# EAGLE schematic Initial v1 (EAGLE 9.6.2)
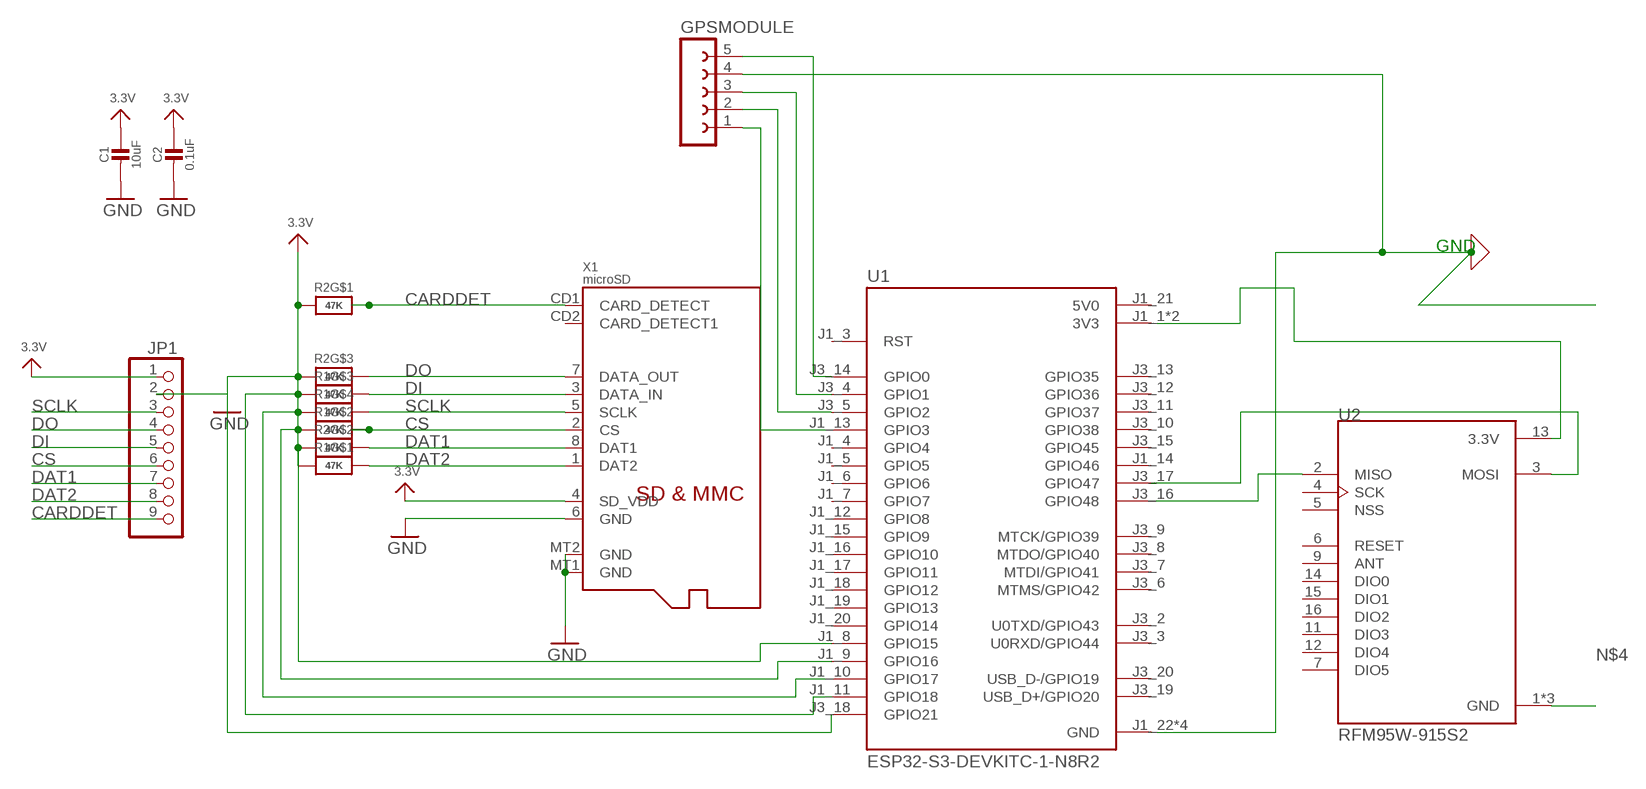
[diagram p0: schematic, sheet 1]

## Parts
C1  10uF  CAP_CERAMIC0805-NOOUTLINE  [0805-NO]
C2  0.1uF  CAP_CERAMIC0603_NO  [0603-NO]
GPSMODULE  FE05-1  [FE05-1]
JP1  HEADER-1X970MIL  [1X09_ROUND_70]
R1  47K  RESISTOR_4PACK  [RESPACK_4X0603]
R2  47K  RESISTOR_4PACK  [RESPACK_4X0603]
U1  ESP32-S3-DEVKITC-1-N8R2  [XCVR_ESP32-S3-DEVKITC-1-N8R2]
U2  RFM95W-915S2  [XCVR_RFM95W-915S2]
X1  microSD  MICROSD  [MICROSD]

## Nets
0: GPSMODULE.4 U1.J1_22(GND) U1.J3_1(GND) U1.J3_21(GND) U1.J3_22(GND) ; supply symbol labelled GND
3.3V: C1.1 C2.1 JP1.1 R1.1 R1.2 R1.3 R1.4 R2.1 R2.2 R2.3 U1.J1_8(GPIO15) U1.J1_9(GPIO16) U1.J1_10(GPIO17) U1.J1_11(GPIO18) U1.J3_18(GPIO21) X1.4(SD_VDD)
CARDDET: JP1.9 R2.8 X1.CD1(CARD_DETECT)
CS: JP1.6 R1.7 X1.2(CS)
DAT1: JP1.7 R2.7 X1.8(DAT1)
DAT2: JP1.8 R1.8 X1.1(DAT2)
DI: JP1.5 R1.6 X1.3(DATA_IN)
DO: JP1.4 R2.6 X1.7(DATA_OUT)
GND: C1.2 C2.2 JP1.2 X1.6(GND) X1.MT1(GND) X1.MT2(GND)
N$1: U1.J1_1(3V3) U1.J1_2(3V3) U2.13(3.3V)
N$2: U1.J3_17(GPIO47) U2.3(MOSI)
N$3: U1.J3_16(GPIO48) U2.2(MISO)
N$4: U2.1(GND) U2.8(GND) U2.10(GND)
N$5: GPSMODULE.5 U1.J3_14(GPIO0)
N$6: GPSMODULE.3 U1.J3_4(GPIO1)
N$7: GPSMODULE.2 U1.J3_5(GPIO2)
N$8: GPSMODULE.1 U1.J1_13(GPIO3)
SCLK: JP1.3 R1.5 X1.5(SCLK)
Unconnected: R2.4 R2.5 U1.J1_3(RST) U1.J1_4(GPIO4) U1.J1_5(GPIO5) U1.J1_6(GPIO6) U1.J1_7(GPIO7) U1.J1_12(GPIO8) U1.J1_14(GPIO46) U1.J1_15(GPIO9) U1.J1_16(GPIO10) U1.J1_17(GPIO11) U1.J1_18(GPIO12) U1.J1_19(GPIO13) U1.J1_20(GPIO14) U1.J3_2(U0TXD/GPIO43) U1.J3_3(U0RXD/GPIO44) U1.J3_6(MTMS/GPIO42) U1.J3_7(MTDI/GPIO41) U1.J3_8(MTDO/GPIO40) U1.J3_9(MTCK/GPIO39) U1.J3_10(GPIO38) U1.J3_11(GPIO37) U1.J3_12(GPIO36) U1.J3_13(GPIO35) U1.J3_15(GPIO45) U1.J3_19(USB_D+/GPIO20) U1.J3_20(USB_D-/GPIO19) U2.4(SCK) U2.5(NSS) U2.6(RESET) U2.7(DIO5) U2.9(ANT) U2.11(DIO3) U2.12(DIO4) U2.14(DIO0) U2.15(DIO1) U2.16(DIO2) X1.CD2(CARD_DETECT1)

## Notes on the sheet
- GND

## Power pins joined to a net without a drawn wire
5V0: U1.J1_21(5V0)

## Library data of the parts
C1 C2 = microbuilder:CAP_CERAMIC: Ceramic Capacitors For new designs, use the packages preceded by an '_' character since they are more reliable: The following footprints should be used on most boards: _0402 - Standard footprint for regular board layouts _0603 - Standard footprint for regular board layouts _0805 - Standard footprint for regular board layouts _1206 - Standard footprint for regular board layouts For extremely tight-pitch boards where space is at a premium, the following 'micro-pitch' footprints can be used (smaller pads, no silkscreen outline, etc.): _0402MP - Micro-pitch footprint for very dense/compact boards _0603MP - Micro-pitch footprint for very dense/compact boards _0805MP - Micro-pitch footprint for very dense/compact boards _1206MP - Micro-pitch footprint for very dense/compact boards
GPSMODULE = con-lsta:FE05-1: FEMALE HEADER; OC_FARNELL: unknown; OC_NEWARK: unknown
JP1 = microbuilder:HEADER-1X9: PIN HEADER
R1 R2 = microbuilder:RESISTOR_4PACK: Resistor Packs (4 resistors) 4 x 0603 10K 1/16W - Digikey: YC164J-10KCT-ND
U1 = ESP32-S3-DEVKITC-1-N8R2:ESP32-S3-DEVKITC-1-N8R2: Check availability <https://pricing.snapeda.com/parts/ESP32-S3-DEVKITC-1-N8R2/Espressif%20Systems/view-part?ref=eda>; AVAILABILITY: In Stock; CHECK_PRICES: https://www.snapeda.com/parts/ESP32-S3-DEVKITC-1-N8R2/Espressif+Systems/view-part/?ref=eda; DESCRIPTION: WiFi Development Tools - 802.11 (Engineering Samples Only) ESP32-S3 General-Purpose Development Board, ESP32-S3-WROOM-1-N8R2, with Pin Header; MF: Espressif Systems; MP: ESP32-S3-DEVKITC-1-N8R2; PACKAGE: None; PRICE: None; PURCHASE-URL: https://www.snapeda.com/api/url_track_click_mouser/?unipart_id=8918256&manufacturer=Espressif Systems&part_name=ESP32-S3-DEVKITC-1-N8R2&search_term=esp32-s3; SNAPEDA_LINK: https://www.snapeda.com/parts/ESP32-S3-DEVKITC-1-N8R2/Espressif+Systems/view-part/?ref=snap
U2 = RFM95W-915S2:RFM95W-915S2: RFM95(W) - Low Power Long Range Transceiver Module V1.0 Check availability <https://pricing.snapeda.com/parts/RFM95W-915S2/HOPERF/view-part?ref=eda>; AVAILABILITY: In Stock; CHECK_PRICES: https://www.snapeda.com/parts/RFM95W-915S2/HOPERF/view-part/?ref=eda; DESCRIPTION: RF TRANSCEIVER MODULE, 915MHZ, 13DBM; RF Modulation: FSK, GFSK, GMSK, MSK, OOK; Data Rate Max: 300Kbps; Frequency Max: 915MHz; Sensitivity dBm: -148dBm; Supply Voltage Min: 1.8V; Supply Voltage Max: 3.7V; Transmit Power: 13dBm; Module Interface: SPI; Supply Current: 120mA; RF Transceiver Applications: Automated Meter Reading, Industrial Monitoring & Control, Home & Building Automation; Product Range: LoRa RFM95 Series; SVHC: No SVHC (12-Jan-2017); MF: HOPERF; MP: RFM95W-915S2; PACKAGE: None; PRICE: None; SNAPEDA_LINK: https://www.snapeda.com/parts/RFM95W-915S2/HOPERF/view-part/?ref=snap
X1 = microbuilder:MICROSD: MicroSD/Transflash Card Holder with SPI pinout 3M: 2908-05WB-MG 4UConnector: 19656 Footprint courtesy: Adafruit Industries